# Altium schematic sheet ESP-Prj.SchDoc
size A4
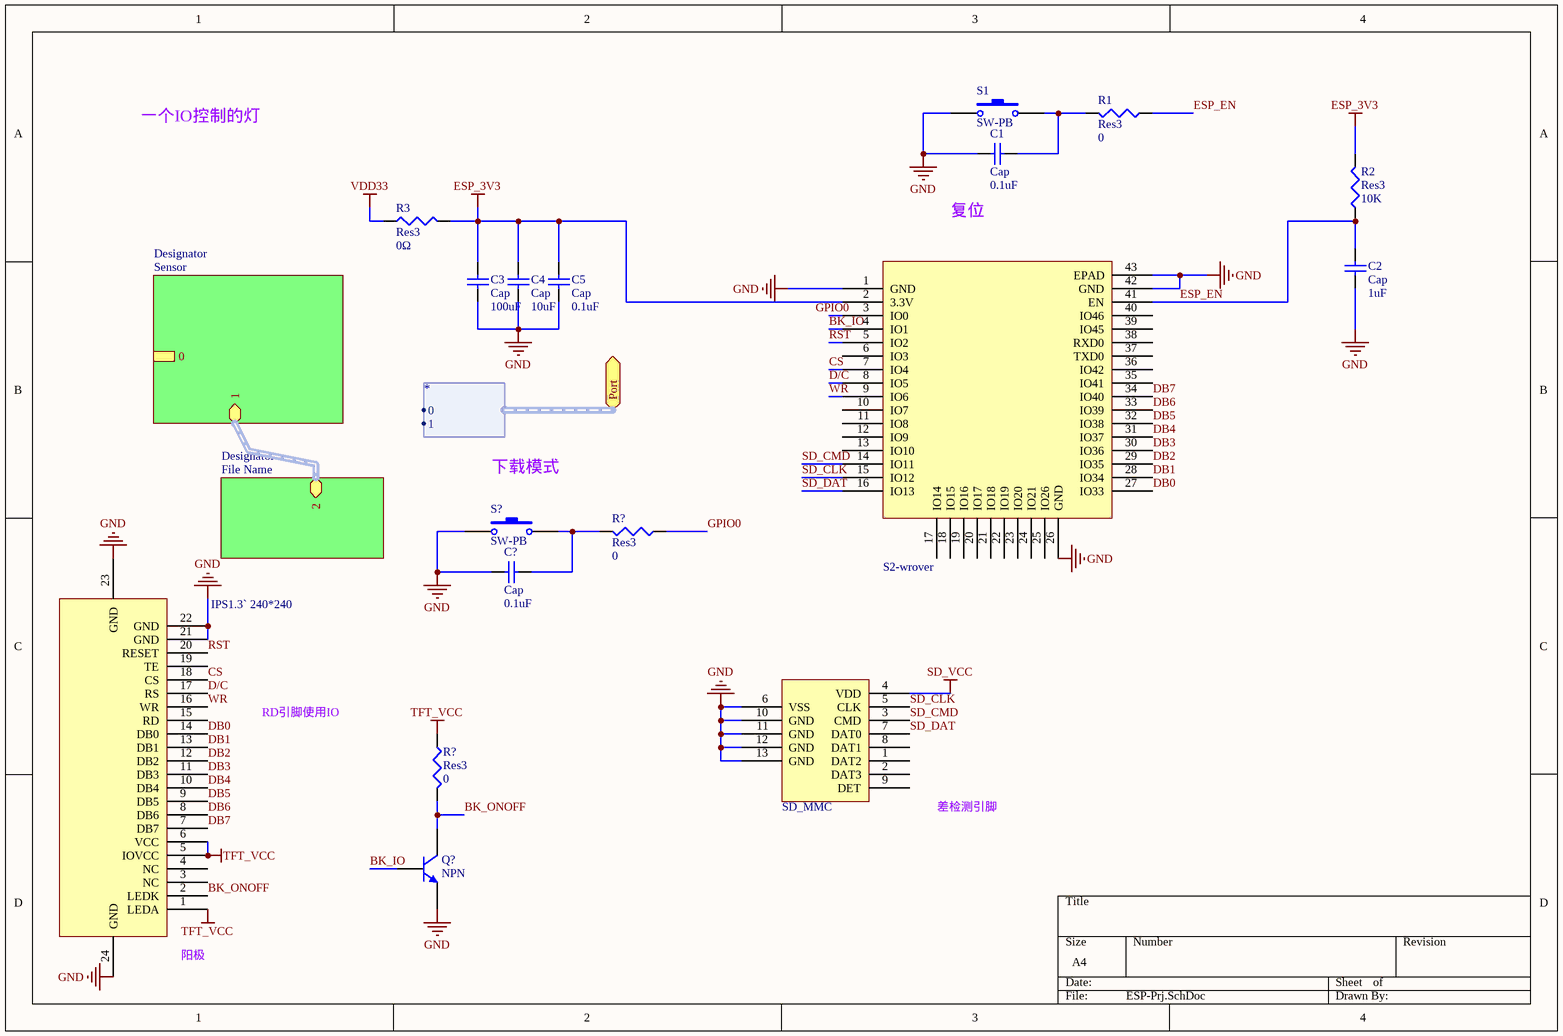
[diagram p0: ESP-Prj.SchDoc]

## Parts
(Parts that share a designator on the sheet are numbered #1, #2 ... from top to bottom, then left to right.)
?#1  S2-wrover  (part C of 3)
?#2  SD_MMC
?#3  IPS1.3` 240*240
C1  Cap  value 0.1uF  [RAD-0.3]
C2  Cap  value 1uF  [RAD-0.3]
C3  Cap  value 100uF  [RAD-0.3]
C4  Cap  value 10uF  [RAD-0.3]
C5  Cap  value 0.1uF  [RAD-0.3]
C?  Cap  value 0.1uF  [RAD-0.3]
Q?  NPN  [TO-226-AA]
R1  Res3  value 0  [12Z-2010]
R2  Res3  value 10K  [12Z-2010]
R3  Res3  value 0Ω  [12Z-2010]
R?#1  Res3  value 0  [12Z-2010]
R?#2  Res3  value 0  [12Z-2010]
S1  SW-PB  [SPST-2]
S?  SW-PB  [SPST-2]

## Sub-sheets
Designator = Sensor: 0, 1 (bidir)
Designator = File Name: 2 (bidir)

## Ports
Port (bidir)

## Harnesses
*: 0, 1

## Nets
ESP_3V3: ?#1.2(3.3V) C3.2 C4.2 C5.2 R2.2 R3.2
GND: ?#1.1(GND) ?#1.26(GND) ?#1.42(GND) ?#1.43(EPAD) ?#2.6(VSS) ?#2.10(GND) ?#2.11(GND) ?#2.12(GND) ?#2.13(GND) ?#3.21(GND) ?#3.22(GND) ?#3.23(GND) ?#3.24(GND) C1.2 C2.1 C3.1 C4.1 C5.1 C?.2 Q?.3(E) S1.1 S?.1
SD_VCC: ?#2.4(VDD)
TFT_VCC: ?#3.1(LEDA) ?#3.5(IOVCC) ?#3.6(VCC) R?#2.1
VDD33: R3.1
BK_IO: ?#1.4(IO1) Q?.2(B)
BK_ONOFF: ?#3.2(LEDK) Q?.1(C) R?#2.2
CS: ?#1.7(IO4) ?#3.18(CS)
D/C: ?#1.8(IO5) ?#3.17(RS)
DB0: ?#1.27(IO33) ?#3.14(DB0)
DB1: ?#1.28(IO34) ?#3.13(DB1)
DB2: ?#1.29(IO35) ?#3.12(DB2)
DB3: ?#1.30(IO36) ?#3.11(DB3)
DB4: ?#1.31(IO37) ?#3.10(DB4)
DB5: ?#1.32(IO38) ?#3.9(DB5)
DB6: ?#1.33(IO39) ?#3.8(DB6)
DB7: ?#1.34(IO40) ?#3.7(DB7)
ESP_EN: ?#1.41(EN) C2.2 R1.1 R2.1
GPIO0: R?#1.1
RST: ?#1.5(IO2) ?#3.20(RESET)
SD_CLK: ?#1.15(IO12) ?#2.5(CLK)
SD_CMD: ?#1.14(IO11) ?#2.3(CMD)
SD_DAT: ?#1.16(IO13) ?#2.7(DAT0)
WR: ?#1.9(IO6) ?#3.16(WR)
NetC1_1: C1.1 R1.2 S1.2
NetC?_1: C?.1 R?#1.2 S?.2

Not connected (* = marked no-connect by the designer): ?#1 3(IO0) 6(IO3) 10(IO7) 11(IO8) 12(IO9) 13(IO10) 17(IO14) 18(IO15) 19(IO16) 20(IO17) 21(IO18) 22(IO19) 23(IO20) 24(IO21) 25(IO26) 35(IO41) 36(IO42) 37(TXD0) 38(RXD0) 39(IO45) 40(IO46); ?#2 1(DAT2) 2(DAT3) 8(DAT1) 9(DET); ?#3 3(NC) 4(NC) 15(RD) 19(TE)

## Buses and harness runs
harness sheet Designator/1 = sheet Designator/2

## Notes on the sheet
- 一个IO控制的灯
- (near C1) 复位
- 下载模式
- RD引脚使用IO
- 差检测引脚
- 阳极
- Labels drawn without touching a wire or pin: GPIO0

## Library data of the parts
?#1 = ESP32-S2
?#2 = TF_SD
?#3 = IPS_LCD
C1-C5 C? = Cap: Capacitor; Published: 8-Jun-2000; LatestRevisionDate: 17-Jul-2002; LatestRevisionNote: Re-released for DXP Platform.; PackageReference: RAD-0.3; Publisher: Altium Limited; PackageDescription: Radial Cap, Thru-Hole; 2 Leads; 0.3 in Pin Spacing
Q? = NPN: NPN Bipolar Transistor; Published: 8-Jun-2000; LatestRevisionDate: 17-Jul-2002; LatestRevisionNote: Re-released for DXP Platform.; PackageReference: TO-226-AA; Publisher: Altium Limited; PackageDescription: TO, Flat Index; 3 In-Line, Axial Leads; Body Dia. 4.8mm; Leads 0.55 x 0.51 mm (max); Code_JEDEC: TO-226-AA
R1-R3 R?#1 R?#2 = Res3: Resistor; Published: 8-Jun-2000; LatestRevisionDate: 29-May-2009; LatestRevisionNote: IPC-7351 Footprint Added.; PackageReference: J1-0603; Publisher: Altium Limited; PackageDescription: Chip Resistor
S1 S? = SW-PB: Switch; Published: 24-Mar-1999; LatestRevisionDate: 17-Jul-2002; LatestRevisionNote: Re-released for DXP Platform.; PackageReference: SPST-2; Publisher: Altium Limited; PackageDescription: Switch; 2 Leads